# EAGLE design Balun_Board_mb (EAGLE 6.6.0)
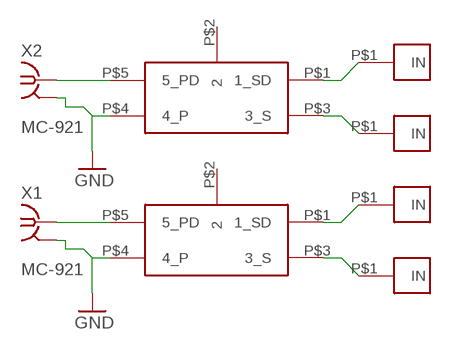
[diagram p0: schematic, sheet 1]

## Parts
U$1  MABA-007159-000000  [MABA-007159-000000]
U$2  MABA-007159-000000  [MABA-007159-000000]
U$5  SMD-WIRE  [SMD-WIRE]
U$6  SMD-WIRE  [SMD-WIRE]
U$7  SMD-WIRE  [SMD-WIRE]
U$8  SMD-WIRE  [SMD-WIRE]
X1  MC-921  [MC-921]
X2  MC-921  [MC-921]

## Nets
GND: U$1.P$4(4_P) U$2.P$4(4_P) X1.2@1(GND) X1.2@2(GND) X2.2@1(GND) X2.2@2(GND)
N$1: U$1.P$5(5_PD) X2.1
N$3: U$2.P$5(5_PD) X1.1
N$5: U$2.P$1(1_SD) U$7.P$1(IN)
N$6: U$2.P$3(3_S) U$8.P$1(IN)
N$7: U$1.P$1(1_SD) U$5.P$1(IN)
N$8: U$1.P$3(3_S) U$6.P$1(IN)
Unconnected: U$1.P$2 U$2.P$2

## Library data of the parts
U$1 U$2 = CubeSat:MABA-007159-000000: Balun MABA-007159-000000 Balun for the CubeSat project
U$5-U$8 = CubeSat:SMD-WIRE
X1 X2 = con-coax:MC-921: COAX. MICROWAVE CONNECTOR O/D diam 2.1 Source: www.tycoelectronics.com .. Electronics .. ENG_CD_1775146_A2.pdf; OC_FARNELL: unknown; OC_NEWARK: unknown

## Board
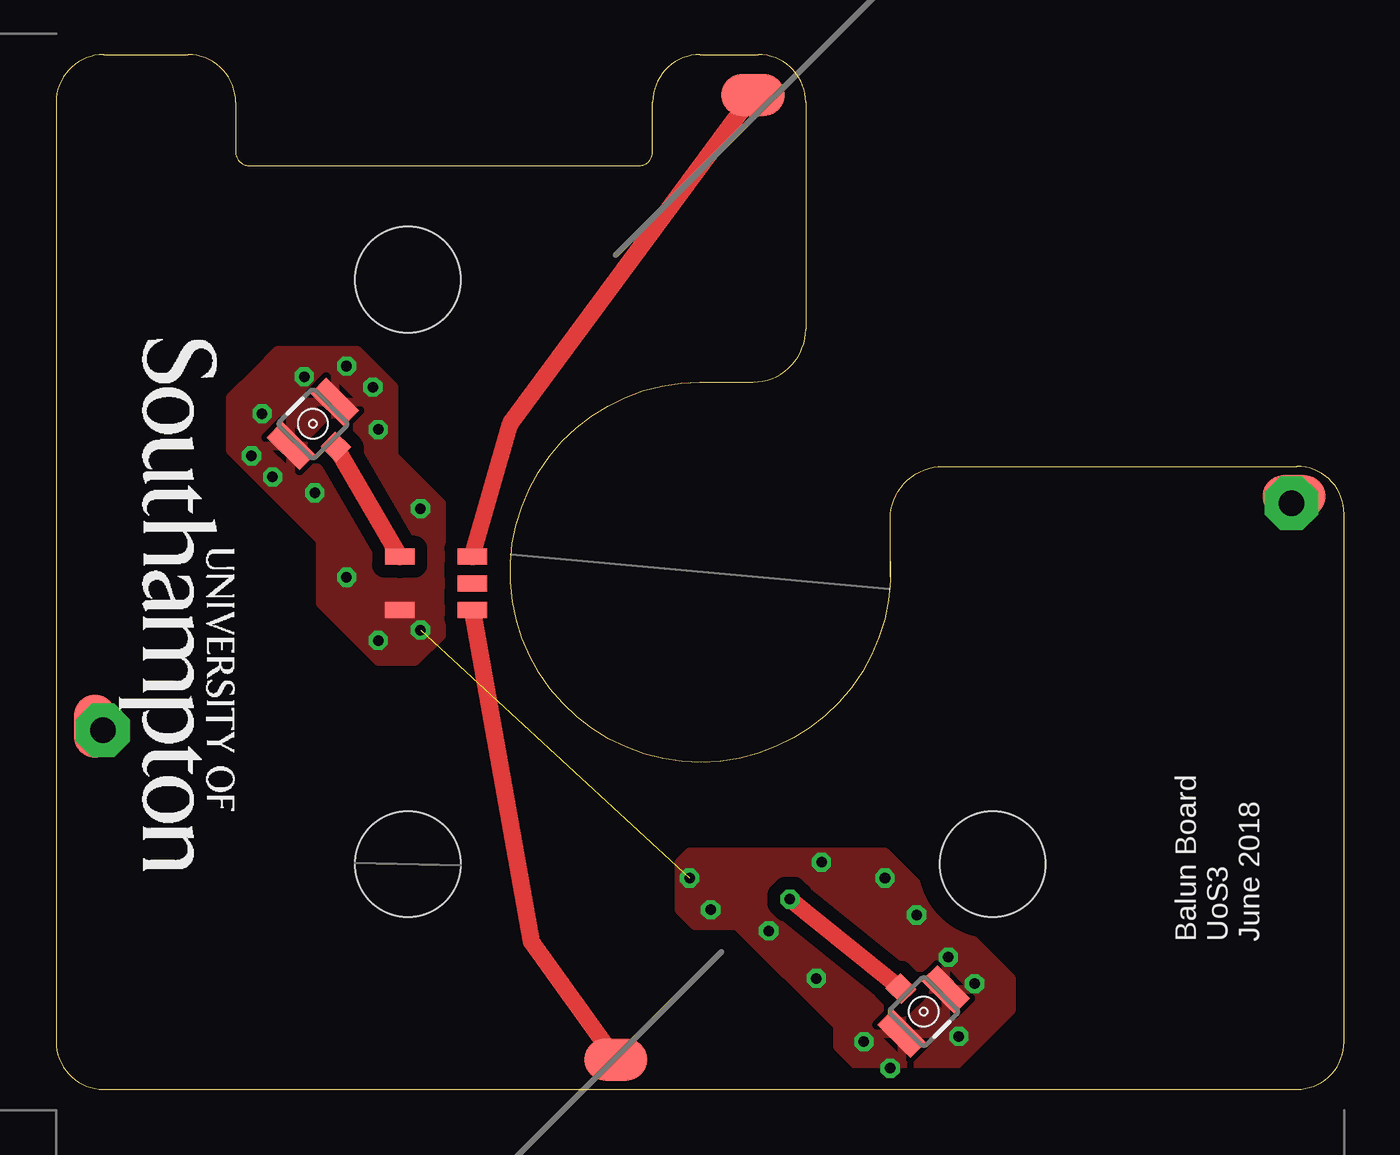
[diagram p1: board, top side]
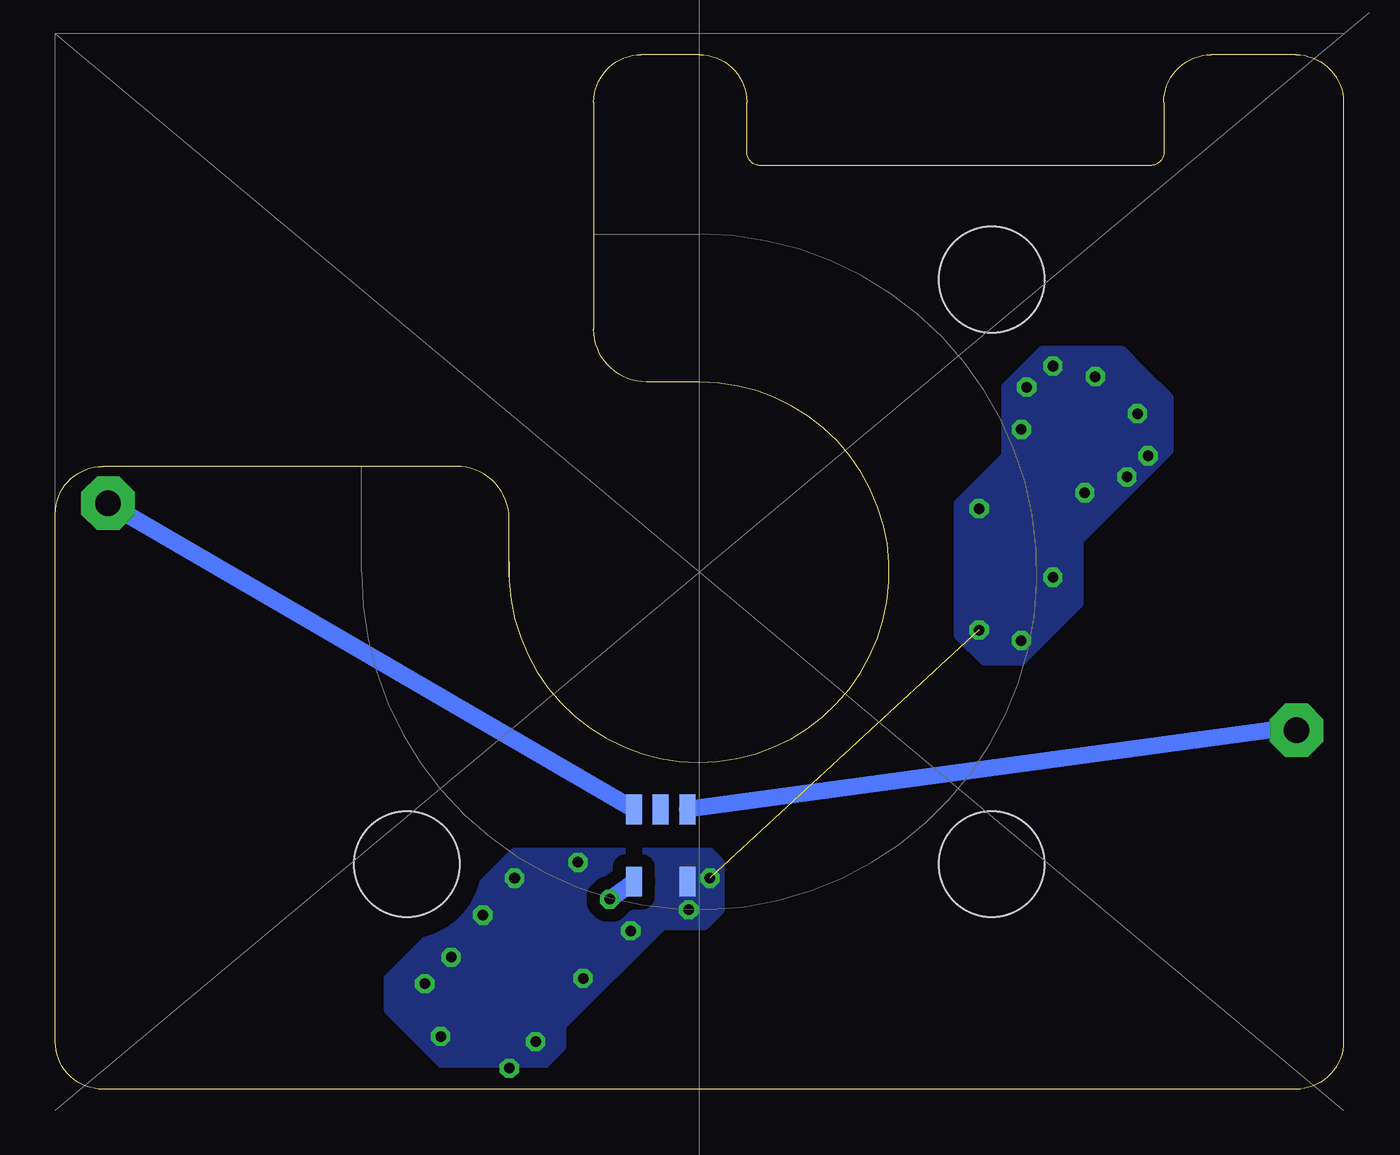
[diagram p2: board, bottom side, seen from below]

Size 61 x 49 mm. Coordinates in mm from the lower left corner, seen from the top.
Outline: 35.5,40.5 35.5,46.75 arc90 33.25,49 30.5,49 arc90 28.25,46.75 28.25,44.38 arc-90 27.61,43.75 9.13,43.75 arc-90 8.5,44.38 8.5,46.75 arc90 6.25,49 2.25,49 arc90 0,46.75 0,2.25 arc90 2.25,0 58.75,0 arc90 61,2.25 61,27.25 arc90 58.75,29.5 42,29.5 arc90 39.5,27 39.5,25
Outline: 35.5,40.75 35.5,36 arc-90 33,33.5 30.5,33.5 arc273 39.5,25
Outline: 39.5,24.25 39.5,25
Copper layers (1*16): Top 0.035mm / dielectric 1.5mm / Bottom 0.035mm
Design rules "default *": minimum track width 10mil, minimum drill 24mil, track to track 8mil, track to pad 8mil, pad to pad 8mil, via to via 8mil, smd to smd 8mil, copper to edge 40mil, drill to drill 8mil, minimum pad ring 10mil, minimum via ring 8mil, stop-mask expansion 4mil, vias tented up to drill 20mil, thermal gap 10mil
Holes 5 mm at 16.66,10.66 44.35,10.66 16.66,38.34

### Footprints (pad centres in the part's own frame; a part is rotated, then mirrored left to right if it is on the bottom)
MABA-007159-000000 = smd 0.76 x 1.4: P$1 -1.27,1.715; P$2 0,1.715; P$3 1.27,1.715; P$4 1.27,-1.715; P$5 -1.27,-1.715
SMD-WIRE = smd 3 x 2: P$1 0,0
MC-921 = smd 1 x 1.05: 1 0,1.528 | smd 1.05 x 2.2: 2@1 -1.475,0; 2@2 1.475,0

### Placement (x,y rotation side)
U$1  32.33,11.54 0 bottom
U$2  17.99,23.96 270 top
U$3  [UOS_LOGO_SML]  3,35.5 270 top
U$5  58.62,28.09 0 top
U$6  1.84,17.19 270 top
U$7  33,47.09 0 top
U$8  26.51,1.4 0 top
X1  12.16,31.51 225 top
X2  41.09,3.68 45 top

### Tracks (layer width: path | path; a pad name or v marks a point on that pad's centre or on a via)
GND  (via drill 0.5)  (1 unrouted)
  other vias: 36.25,10.75 42.25,6.25 43.5,5 42.75,2.5 39.5,1 38.25,2.25 36,5.25 33.75,7.5 31,8.5 30,10 39.25,10 40.75,8.25 9.75,32 11.75,33.75 13.75,34.25 15,33.25 15.25,31.25 9.25,30 10.25,29 12.25,28.25 13.75,24.25 15.25,21.25 17.25,21.75 17.25,27.5
  pour Bottom (isolate 0.61): 30.75,11.25 39.25,11.25 45.25,5.25 45.25,3.75 41.5,0 39,0 37,2 37,3 32.25,7.75 30.25,7.75 29.5,8.5 29.5,10.75 30,11.25
  pour Top (isolate 0.61): 13,35 14.25,35 16,33.25 16,30 18.25,27.75 18.25,21.5 17,20.25 15.25,20.25 12.5,23 12.5,26 8.25,30.25 8.25,32.75 9.5,34 10.5,35
  pour Bottom (isolate 0.61): 13,35 14.25,35 16,33.25 16,30 18.25,27.75 18.25,21.5 17,20.25 15.25,20.25 12.5,23 12.5,26 8.25,30.25 8.25,32.75 9.5,34 10.5,35
  pour Top (isolate 0.61): 30.75,11.25 39.25,11.25 45.25,5.25 45.25,3.75 41.5,0 39,0 37,2 37,3 32.25,7.75 30.25,7.75 29.5,8.5 29.5,10.75 30,11.25
N$1  (via drill 0.5)
  Top 0.813: X2.1 v34.75,9
  Bottom 0.813: v34.75,9 U$1.P$5
N$3
  Top 0.813: U$2.P$5 X1.1
N$5
  Top 0.813: U$2.P$1 21.5,31.5 U$7.P$1
N$6
  Top 0.813: U$2.P$3 22.5,7 U$8.P$1
N$7  (via drill 1.2 pad 2.54)
  Top 0.406: v58.5,27.75 U$5.P$1
  Bottom 0.813: U$1.P$1 v58.5,27.75
N$8  (via drill 1.2 pad 2.54)
  Top 0.813: U$6.P$1 arc90 v2.22,17
  Bottom 0.813: v2.22,17 3.5,17 U$1.P$3

### Text on the board
tPlace: Balun Board | UoS3 | June 2018
tDocu: cutout for deployment